# EAGLE design AlarmClock (EAGLE 5.11)
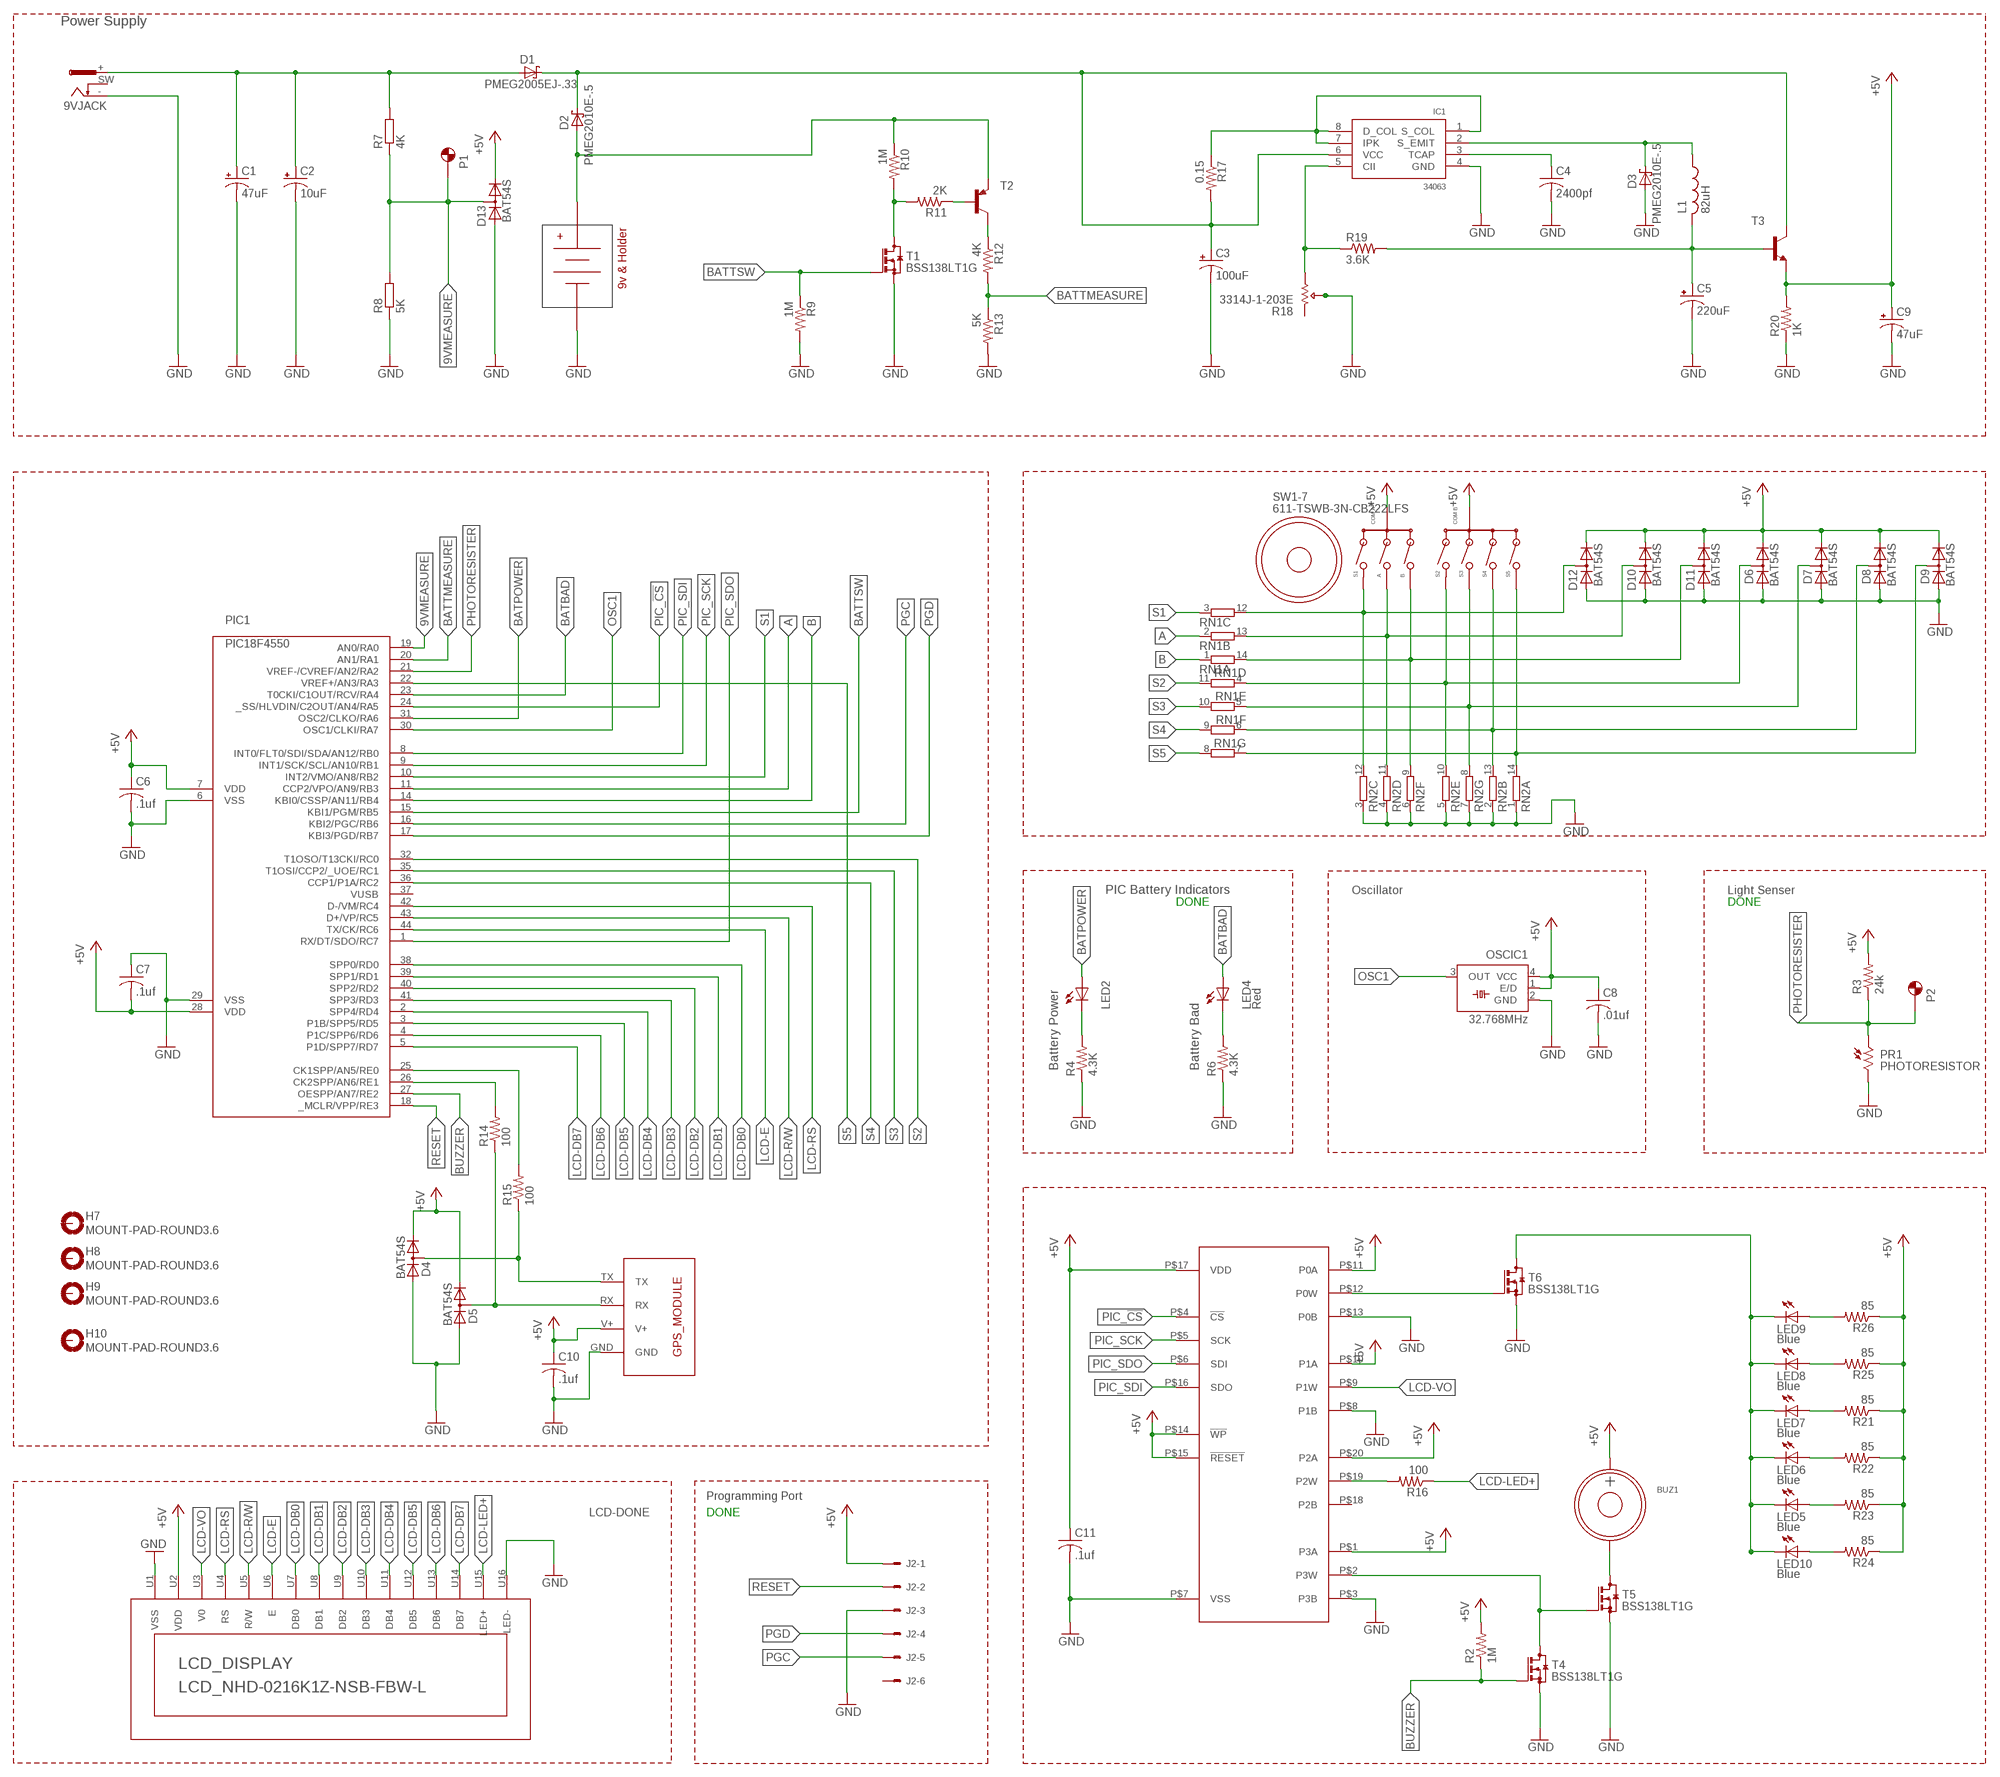
[diagram p0: schematic, sheet 1]

## Parts
9VJACK  PWR_JACK  [PWR_JACK]
BUZ1  SPEAKER2  [SPEAKER2]
C1  47uF  CPOL-USE2-5  [E2-5]
C2  10uF  CPOL-USE2-5  [E2-5]
C3  100uF  CPOL-USE2.5-5  [E2,5-5]
C4  2400pf  C-USC0805  [C0805]
C5  220uF  CPOL-USE2.5-5  [E2,5-5]
C6  .1uf  C-USC0805  [C0805]
C7  .1uf  C-USC0805  [C0805]
C8  .01uf  C-USC0805  [C0805]
C9  47uF  CPOL-USE2-5  [E2-5]
C10  .1uf  C-USC0805  [C0805]
C11  .1uf  C-USC0805  [C0805]
D1  PMEG2005EJ-.33  SMF5.0AT1  [SOD123FL]
D2  PMEG2010E-.5  SMF5.0AT1  [SOD123FL]
D3  PMEG2010E-.5  SMF5.0AT1  [SOD123FL]
D4  BAT54S  BAV199  [SOT23]
D5  BAT54S  BAV199  [SOT23]
D6  BAT54S  BAV199  [SOT23]
D7  BAT54S  BAV199  [SOT23]
D8  BAT54S  BAV199  [SOT23]
D9  BAT54S  BAV199  [SOT23]
D10  BAT54S  BAV199  [SOT23]
D11  BAT54S  BAV199  [SOT23]
D12  BAT54S  BAV199  [SOT23]
D13  BAT54S  BAV199  [SOT23]
H2  GPS_MODULE  [GPS_MODULE]
H7  MOUNT-PAD-ROUND3.6  [3,6-PAD]
H8  MOUNT-PAD-ROUND3.6  [3,6-PAD]
H9  MOUNT-PAD-ROUND3.6  [3,6-PAD]
H10  MOUNT-PAD-ROUND3.6  [3,6-PAD]
IC1  34063  MC34063A  [SOIC8]
J2  22-05-7068-06  [7395-06]
L1  82uH  744776182  [744776182]
LCD_DISPLAY  LCD_NHD-0216K1Z-NSB-FBW-L  [LCD_NHD-0216K1Z-NSB-FBW-L_LESS_PINS]
LED2  Blue  LEDCHIPLED_0603  [CHIPLED_0603]
LED4  Red  LEDCHIPLED_0603  [CHIPLED_0603]
LED5  Blue  LEDCHIPLED_0603  [CHIPLED_0603]
LED6  Blue  LEDCHIPLED_0603  [CHIPLED_0603]
LED7  Blue  LEDCHIPLED_0603  [CHIPLED_0603]
LED8  Blue  LEDCHIPLED_0603  [CHIPLED_0603]
LED9  Blue  LEDCHIPLED_0603  [CHIPLED_0603]
LED10  Blue  LEDCHIPLED_0603  [CHIPLED_0603]
OSCIC1  32.768MHz  SM77H  [SM77H]
P1  PAD-1  [PAD-1-50/25]
P2  PAD-1  [PAD-1-50/25]
PIC1  PIC18F4550  PIC18F4550-I/PT  [TQFP44]
PR1  PHOTORESISTOR  [PHOTORESISTOR]
R2  1M  R-US_M0805  [M0805]
R3  24k  R-US_M0805  [M0805]
R4  4.3K  R-US_M0805  [M0805]
R6  4.3K  R-US_M0805  [M0805]
R7  4K  R-EU_R0805  [R0805]
R8  5K  R-EU_R0805  [R0805]
R9  1M  R-US_M0805  [M0805]
R10  1M  R-US_M0805  [M0805]
R11  2K  R-US_M0805  [M0805]
R12  4K  R-US_M0805  [M0805]
R13  5K  R-US_M0805  [M0805]
R14  100  R-US_M0805  [M0805]
R15  100  R-US_M0805  [M0805]
R16  100  R-US_M0805  [M0805]
R17  0.15  R-US_M0805  [M0805]
R18  3314J-1-203E  [3314J-1-203E]
R19  3.6K  R-US_M0805  [M0805]
R20  1K  R-US_M0805  [M0805]
R21  85  R-US_M0805  [M0805]
R22  85  R-US_M0805  [M0805]
R23  85  R-US_M0805  [M0805]
R24  85  R-US_M0805  [M0805]
R25  85  R-US_M0805  [M0805]
R26  85  R-US_M0805  [M0805]
RN1  7R-NSOMC  [SOMC14]
RN2  7R-NSOMC  [SOMC14]
SW1-7  611-TSWB-3N-CB222LFS  [611-TSWB-3N-CB222LFS]
T1  BSS138LT1G  BSS123  [SOT23]
T2  BC856A-PNP-SOT23-BEC  [SOT23-BEC]
T3  BC818-NPN-SOT23-BEC  [SOT23-BEC]
T4  BSS138LT1G  BSS123  [SOT23]
T5  BSS138LT1G  BSS123  [SOT23]
T6  BSS138LT1G  BSS123  [SOT23]
U$1  9VBATTANHEADER  [9VBATTERYHOLDER]
U$3  DIGITALPOT_MCP4361-103E/ST  [DIGITALPOT_MCP4361-103E/ST]

## Nets
9V_SUPPLY: C3.+ D1.C D2.C IC1.6(VCC) R17.2 T3.C
9V_WALL1: 9VJACK.+ C1.+ C2.+ D1.A R7.2
9VMEASURE: D13.3(AC) P1.P$1 PIC1.19(AN0/RA0) R7.1 R8.2
+5V: BUZ1.POS C6.1 C7.2 C8.1 C9.+ C10.1 C11.1 D4.2(C) D5.2(C) D6.2(C) D7.2(C) D8.2(C) D9.2(C) D10.2(C) D11.2(C) D12.2(C) D13.2(C) H2.V+ J2.1 LCD_DISPLAY.U2(VDD) OSCIC1.1(E/D) OSCIC1.4(VCC) PIC1.7(VDD) PIC1.28(VDD) R2.2 R3.2 R20.2 R21.1 R22.1 R23.1 R24.1 R25.1 R26.1 SW1-7.COM-A SW1-7.COM-B T3.E U$3.P$1(P3A) U$3.P$10(P1A) U$3.P$11(P0A) U$3.P$14(!WP) U$3.P$15(!RESET) U$3.P$17(VDD) U$3.P$20(P2A)
A: PIC1.11(CCP2/VPO/AN9/RB3) RN1.2
B: PIC1.14(KBI0/CSSP/AN11/RB4) RN1.1
BATBAD: LED4.A PIC1.23(T0CKI/C1OUT/RCV/RA4)
BATPOWER: LED2.A PIC1.31(OSC2/CLKO/RA6)
BATTMEASURE: PIC1.20(AN1/RA1) R12.2 R13.1
BATTSW: PIC1.15(KBI1/PGM/RB5) R9.1 T1.1(G)
BUZZER: PIC1.27(OESPP/AN7/RE2) R2.1 T4.1(G)
GND: 9VJACK.- C1.- C2.- C3.- C4.2 C5.- C6.2 C7.1 C8.2 C9.- C10.2 C11.2 D3.A D4.1(A) D5.1(A) D6.1(A) D7.1(A) D8.1(A) D9.1(A) D10.1(A) D11.1(A) D12.1(A) D13.1(A) H2.GND IC1.4(GND) J2.3 LCD_DISPLAY.U1(VSS) LCD_DISPLAY.U16(LED-) OSCIC1.2(GND) PIC1.6(VSS) PIC1.29(VSS) PR1.P$2 R4.1 R6.1 R8.1 R9.2 R13.2 R18.WIPER R20.1 RN2.1 RN2.2 RN2.3 RN2.4 RN2.5 RN2.6 RN2.7 T1.2(S) T4.2(S) T5.2(S) T6.2(S) U$1.P$2- U$3.P$3(P3B) U$3.P$7(VSS) U$3.P$8(P1B) U$3.P$13(P0B)
LCD-DB0: LCD_DISPLAY.U7(DB0) PIC1.38(SPP0/RD0)
LCD-DB1: LCD_DISPLAY.U8(DB1) PIC1.39(SPP1/RD1)
LCD-DB2: LCD_DISPLAY.U9(DB2) PIC1.40(SPP2/RD2)
LCD-DB3: LCD_DISPLAY.U10(DB3) PIC1.41(SPP3/RD3)
LCD-DB4: LCD_DISPLAY.U11(DB4) PIC1.2(SPP4/RD4)
LCD-DB5: LCD_DISPLAY.U12(DB5) PIC1.3(P1B/SPP5/RD5)
LCD-DB6: LCD_DISPLAY.U13(DB6) PIC1.4(P1C/SPP6/RD6)
LCD-DB7: LCD_DISPLAY.U14(DB7) PIC1.5(P1D/SPP7/RD7)
LCD-E: LCD_DISPLAY.U6(E) PIC1.44(TX/CK/RC6)
LCD-LED+: LCD_DISPLAY.U15(LED+) R16.1
LCD-R/W: LCD_DISPLAY.U5(R/W) PIC1.43(D+/VP/RC5)
LCD-RS: LCD_DISPLAY.U4(RS) PIC1.42(D-/VM/RC4)
LCD-VO: LCD_DISPLAY.U3(V0) U$3.P$9(P1W)
N$1: R16.2 U$3.P$19(P2W)
N$2: LED2.C R4.2
N$3: LED10.A R24.2
N$4: R12.1 T2.C
N$6: LED4.C R6.2
N$7: LED5.A R23.2
N$8: LED8.A R25.2
N$9: D2.A R10.1 T2.E U$1.P$1+
N$10: R11.1 T2.B
N$11: LED9.A R26.2
N$12: LED7.A R21.2
N$13: R10.2 R11.2 T1.3(D)
N$14: D4.3(AC) H2.TX R15.1
N$15: D5.3(AC) H2.RX R14.1
N$16: IC1.1(S_COL) IC1.7(IPK) IC1.8(D_COL) R17.1
N$17: D3.C IC1.2(S_EMIT) L1.P$1
N$18: IC1.5(CII) R18.CCW(CW) R19.1
N$19: C4.1 IC1.3(TCAP)
N$20: T4.3(D) T5.1(G) U$3.P$2(P3W)
N$21: BUZ1.NEG T5.3(D)
N$22: LED6.A R22.2
N$23: D6.3(AC) RN1.4 RN2.10 SW1-7.S2
N$25: PIC1.25(CK1SPP/AN5/RE0) R15.2
N$26: PIC1.26(CK2SPP/AN6/RE1) R14.2
N$27: T6.1(G) U$3.P$12(P0W)
N$28: LED5.C LED6.C LED7.C LED8.C LED9.C LED10.C T6.3(D)
N$32: D12.3(AC) RN1.12 RN2.12 SW1-7.S1
N$33: D10.3(AC) RN1.13 RN2.11 SW1-7.A
N$34: D11.3(AC) RN1.14 RN2.9 SW1-7.B
N$35: D7.3(AC) RN1.5 RN2.8 SW1-7.S3
N$36: D8.3(AC) RN1.6 RN2.13 SW1-7.S4
N$37: D9.3(AC) RN1.7 RN2.14 SW1-7.S5
OSC1: OSCIC1.3(OUT) PIC1.30(OSC1/CLKI/RA7)
PGC: J2.5 PIC1.16(KBI2/PGC/RB6)
PGD: J2.4 PIC1.17(KBI3/PGD/RB7)
PHOTORESISTER: P2.P$1 PIC1.21(VREF-/CVREF/AN2/RA2) PR1.P$1 R3.1
PIC_!CS: PIC1.24(_SS/HLVDIN/C2OUT/AN4/RA5) U$3.P$4(!CS)
PIC_SCK: PIC1.9(INT1/SCK/SCL/AN10/RB1) U$3.P$5(SCK)
PIC_SDI: PIC1.8(INT0/FLT0/SDI/SDA/AN12/RB0) U$3.P$16(SDO)
PIC_SDO: PIC1.1(RX/DT/SDO/RC7) U$3.P$6(SDI)
RESET: J2.2 PIC1.18(_MCLR/VPP/RE3)
S1: PIC1.10(INT2/VMO/AN8/RB2) RN1.3
S2: PIC1.32(T1OSO/T13CKI/RC0) RN1.11
S3: PIC1.35(T1OSI/CCP2/_UOE/RC1) RN1.10
S4: PIC1.36(CCP1/P1A/RC2) RN1.9
S5: PIC1.22(VREF+/AN3/RA3) RN1.8
VOUT: C5.+ L1.P$2 R19.2 T3.B
Unconnected: 9VJACK.SW H7.B3,6(MOUNT) H8.B3,6(MOUNT) H9.B3,6(MOUNT) H10.B3,6(MOUNT) J2.6 PIC1.37(VUSB) R18.CW(CCW) U$3.P$18(P2B)

## Notes on the sheet
- Power Supply
- PIC Battery Indicators | Oscillator | Light Senser
- DONE | DONE
- Battery Power | Battery Bad
- Programming Port
- LCD-DONE | DONE

## Library data of the parts
9VJACK = ACommonPart:PWR_JACK
BUZ1 = alarmclock:SPEAKER2
C1-C3 C5 C9 = resistor:CPOL-US: POLARIZED CAPACITOR, American symbol
C4 C6-C8 C10 C11 = rcl:C-US: CAPACITOR, American symbol
D1-D3 = diode:SMF5.0AT1: 200 W Transient Voltage Suppressor Source: Data sheet <http://www.onsemi.com/pub_link/Collateral/SMF5.0AT1-D.PDF>
D4-D13 = diode:BAV199: DIODE low-leakage double diode
H2 = alarmclock:GPS_MODULE
H7-H10 = holes:MOUNT-PAD-ROUND: MOUNTING PAD, round
IC1 = microbuilder:MC34063A: MC34063A - 1.5A 3V-40V Boost/Buck/Inverting Voltage Regulator [Part No.] Allows you to 'boost', reduce or invert the voltage of your power supply to a more appropriate level. Common voltage regulators like the LM1117 are easy to use, but they can only 'reduce' the voltage level and require more volts than they provide, making them useless for low voltage power supplies like batteries or solar panels. A 'Step-Up' regulator like the MC34063A solves this problem by also allowing you to increase the voltage to a pre-determined level, though you still need to pay attention to the minimum voltage level the converter can handle, keeping in mind that many 'step-up' converts are less efficient at the two extreme ends of their working range. Given that many step-up circuits introduce some ripple to the power supply, you can often get a much 'smoother' supply by boosting the voltage up to 5.0V and then using a standard fixed voltage regulator (such as the common LM1117, etc.) to drop the voltage back down to 3.3V. This may not be necessary, and some step up regulators can provide a smooth supply on their own, but it's worth keeping in mind if you do encounter some ripple in the power supply using only a step-up IC for your power supply. Texas Instruments MC34063A Digikey: 296-17765-1-ND
J2 = ep_molex_6410_7395-02:22-?-06: CONNECTOR wire to board 2.54 mm (.1 inch) pitch header
L1 = alarmclock:744776182
LCD_DISPLAY = Project_AlarmClock:LCD_NHD-0216K1Z-NSB-FBW-L: Mouser Part #: 763-0216K1Z-NSB-FBW Manufacturer Part #: NHD-0216K1Z-NSB-FBW-L Manufacturer: Newhaven Display Description: LCD Character Display Modules FSTN (-) Transm 80.0 x 36.0
LED2 LED4-LED10 = led:LED: LED OSRAM: - CHIPLED LG R971, LG N971, LY N971, LG Q971, LY Q971, LO R971, LY R971 LH N974, LH R974 LS Q976, LO Q976, LY Q976 LO Q996 - Hyper CHIPLED LW Q18S LB Q993, LB Q99A, LB R99A - SideLED LS A670, LO A670, LY A670, LG A670, LP A670 LB A673, LV A673, LT A673, LW A673 LH A674 LY A675 LS A676, LA A676, LO A676, LY A676, LW A676 LS A679, LY A679, LG A679 - Hyper Micro SIDELED® LS Y876, LA Y876, LO Y876, LY Y876 LT Y87S - SmartLED LW L88C, LW L88S LB L89C, LB L89S, LG L890 LS L89K, LO L89K, LY L89K LS L896, LA L896, LO L896, LY L896 - TOPLED LS T670, LO T670, LY T670, LG T670, LP T670 LSG T670, LSP T670, LSY T670, LOP T670, LYG T670 LG T671, LOG T671, LSG T671 LB T673, LV T673, LT T673, LW T673 LH T674 LS T676, LA T676, LO T676, LY T676, LB T676, LH T676, LSB T676, LW T676 LB T67C, LV T67C, LT T67C, LS T67K, LO T67K, LY T67K, LW E67C LS E67B, LA E67B, LO E67B, LY E67B, LB E67C, LV E67C, LT E67C LW T67C LS T679, LY T679, LG T679 LS T770, LO T770, LY T770, LG T770, LP T770 LB T773, LV T773, LT T773, LW T773 LH T774 LS E675, LA E675, LY E675, LS T675 LS T776, LA T776, LO T776, LY T776, LB T776 LHGB T686 LT T68C, LB T68C - Hyper Mini TOPLED® LB M676 - Mini TOPLED Santana® LG M470 LS M47K, LO M47K, LY M47K Source: http://www.osram.convergy.de LUXEON: - LUMILED® LXK2-PW12-R00, LXK2-PW12-S00, LXK2-PW14-U00, LXK2-PW14-V00 LXK2-PM12-R00, LXK2-PM12-S00, LXK2-PM14-U00 LXK2-PE12-Q00, LXK2-PE12-R00, LXK2-PE12-S00, LXK2-PE14-T00, LXK2-PE14-U00 LXK2-PB12-K00, LXK2-PB12-L00, LXK2-PB12-M00, LXK2-PB14-N00, LXK2-PB14-P00, LXK2-PB14-Q00 LXK2-PR12-L00, LXK2-PR12-M00, LXK2-PR14-Q00, LXK2-PR14-R00 LXK2-PD12-Q00, LXK2-PD12-R00, LXK2-PD12-S00 LXK2-PH12-R00, LXK2-PH12-S00 LXK2-PL12-P00, LXK2-PL12-Q00, LXK2-PL12-R00 Source: www.luxeon.com KINGBRIGHT: KA-3528ASYC Source: www.kingbright.com
OSCIC1 = crystal:SM77H: 3.3V CMOS Clock Oscillator Source: www.pletronics.com .. sm77h%203.3v.pdf; OC_FARNELL: unknown; OC_NEWARK: unknown
P1 P2 = ACommonPart:PAD-1
PIC1 = microchip-pic18fxx5x:PIC18*4550: PIC18*4550 Microchip FLASH Microcontroller with FS-USB DEVICE FEATURES Feature PIC18*4550 Program Memory (bytes) 32k Program Memory (instructions) 16384 I/O Ports Ports A, B, C, D, E Capture/Compare/PWM Modules 1 Enhanced Capture/Compare/PWM Modules 1 Parallel Communications (PSP) Yes 10-bit Analog-to-Digital Module 13 input Channels Package Types 40-pin PDIP 44-pin TQFP (44-pin QFN) NOTES: F only after 18, means standard voltage range from 4.2v to 5.5v LF after 18, means extended voltage range from 2.0v to 5.5v T after entire device number, means supplied in tape and reel TQFP packages only -E before / denotes extended temperature range from -40°C to +120°C -I before / denotes industrial temperature range from -40°C to +85°C /PT suffix denotes TQFP package /SO suffix denotes SOIC package /SP suffix denotes Skinny Plastic DIP package /P suffix denotes Plastic DIP package /ML suffix denotes QFN package
PR1 = alarmclock:PHOTORESISTOR
R2-R4 R6 R9-R17 R19-R26 = rcl:R-US_: RESISTOR, American symbol
R7 R8 = resistor:R-EU_: RESISTOR, European symbol
R18 = alarmclock:3314J-1-203E
RN1 RN2 = resistor-dil:7R-N: DIL RESISTOR; OC_FARNELL: unknown; OC_NEWARK: unknown
SW1-7 = alarmclock:611-TSWB-3N-CB222LFS
T1 T4-T6 = transistor-small-signal:BSS123: N-CHANNEL MOS FET
T2 = transistor:*-PNP-: PNP Transistror
T3 = transistor:*-NPN-: NPN Transistror BF959 corrected 2008.03.06
U$1 = alarmclock:9VBATTANHEADER
U$3 = Project_AlarmClock:DIGITALPOT_MCP4361-103E/ST

## Board
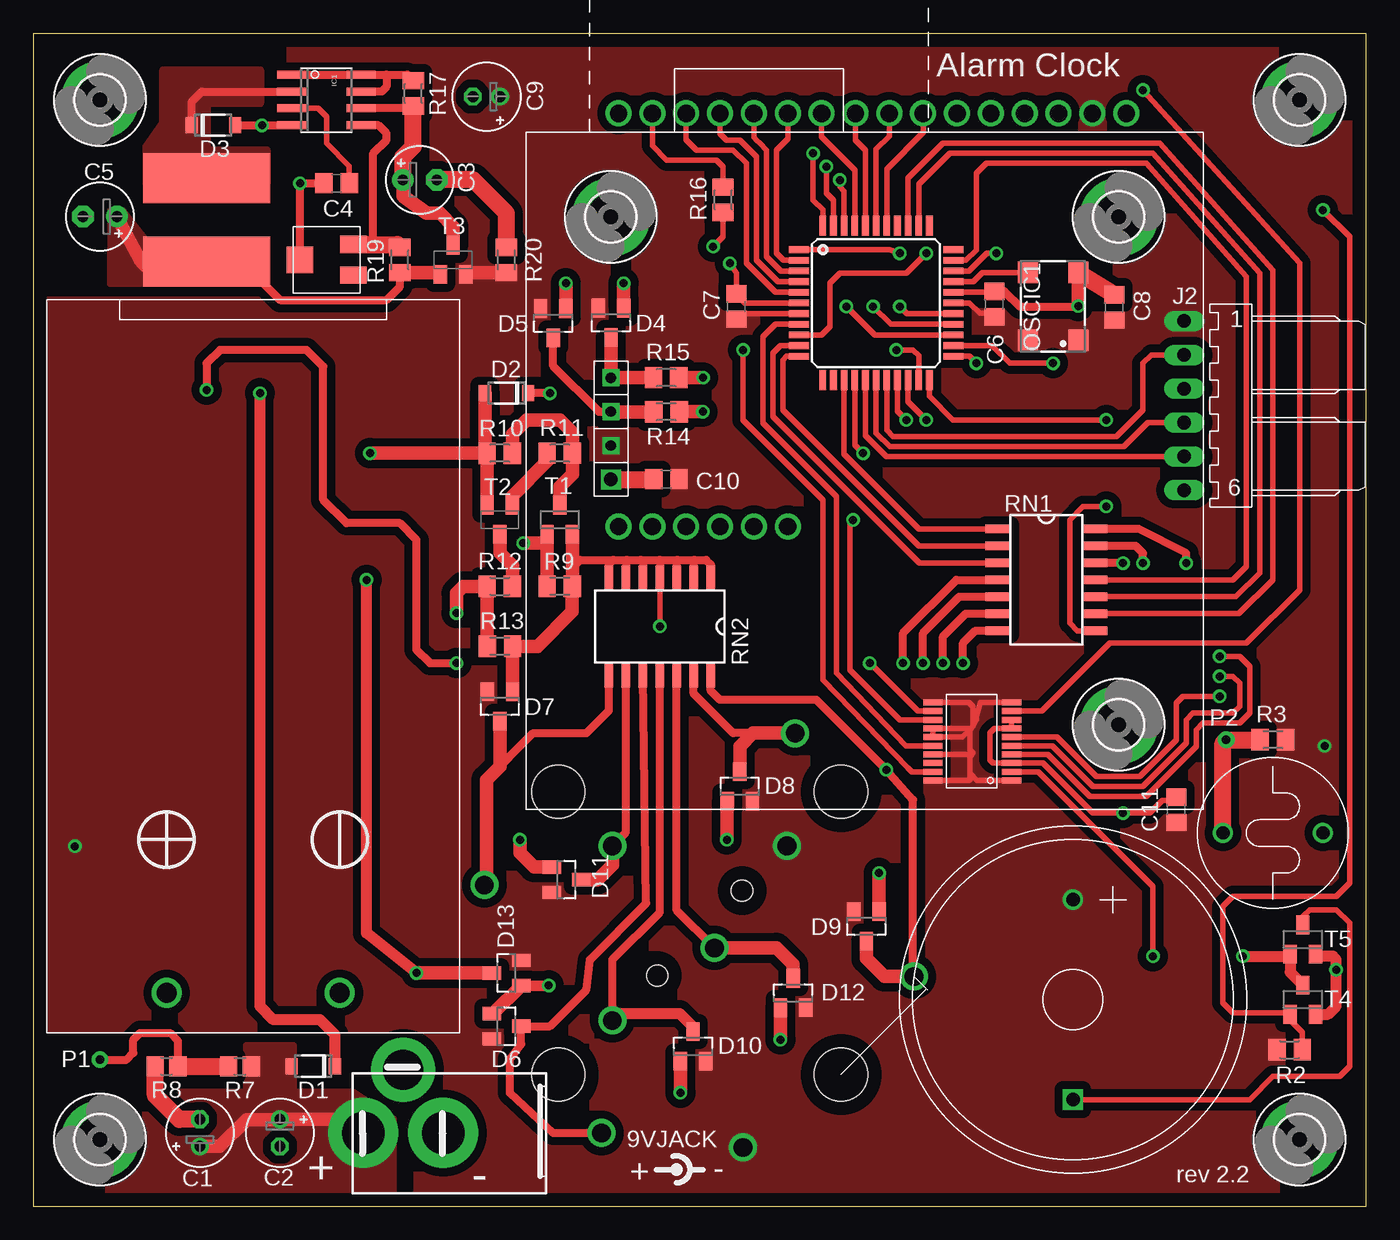
[diagram p1: board, top side]
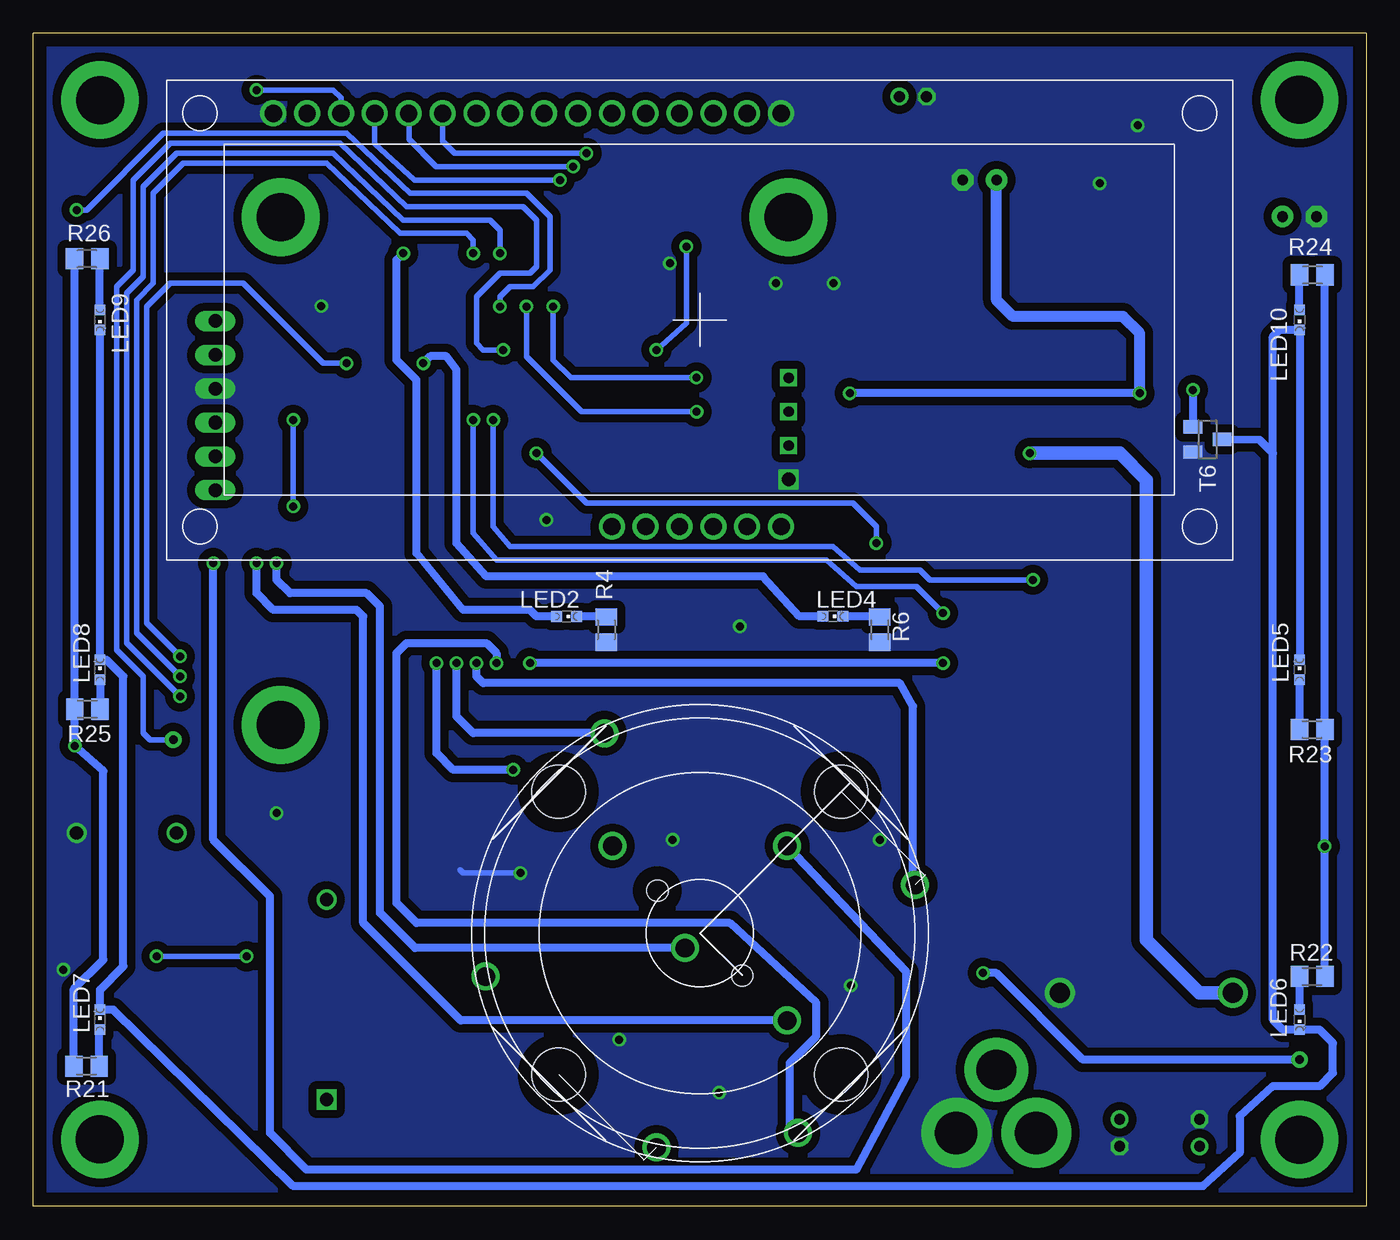
[diagram p2: board, bottom side, seen from below]

Size 100 x 88 mm. Coordinates in mm from the lower left corner, seen from the top.
Outline: 0,0 100,0 100,88 0,88 0,0
Copper layers (1*16): Top 0.035mm / dielectric 1.5mm / Bottom 0.035mm
Design rules "default *": minimum track width 10mil, minimum drill 0.5mm, track to track 0.2mm, track to pad 0.2mm, pad to pad 0.2mm, via to via 0.2mm, smd to smd 0.2mm, copper to edge 40mil, drill to drill 8mil, minimum pad ring 10mil, minimum via ring 8mil, stop-mask expansion 4mil, vias tented up to drill 0mil, thermal gap 10mil

### Footprints (pad centres in the part's own frame; a part is rotated, then mirrored left to right if it is on the bottom)
PWR_JACK = drill 3.175 pad 5.25 round: + 5.75,0; - -0.25,0 | drill 2.997 pad 4.8 round: SW 2.75,-4.75
SPEAKER2 = drill 1 square: NEG 0,-7.5 | drill 1 round: POS 0,7.5
E2-5 = drill 0.813 pad 1.27 round: + -1.016,0 | drill 0.813 pad 1.27 octagon: - 1.016,0
E2,5-5 = drill 0.813 pad 1.6 round: + -1.27,0 | drill 0.813 pad 1.6 octagon: - 1.27,0
C0805 = smd 1.3 x 1.5: 1 -0.95,0; 2 0.95,0
SOD123FL = smd 0.91 x 1.22: A 1.625,0; C -1.625,0
SOT23 = smd 1 x 1.4: 1 -0.95,-1.1; 2 0.95,-1.1; 3 0,1.1
GPS_MODULE = drill 3.6 pad 5.842 round: B3,1 6.35,44.45; B3,3 44.45,44.45; B3,6 44.45,6.35 | drill 1 square: GND 6.351,24.763 | drill 0.762 square: RX 6.351,29.843; TX 6.351,32.383; V+ 6.351,27.303
3,6-PAD = drill 3.6 pad 5.842 round: B3,6 0,0
SOIC8 = smd 0.6 x 2.2: 1 -1.905,-2.6; 2 -0.635,-2.6; 3 0.635,-2.6; 4 1.905,-2.6; 5 1.905,2.6; 6 0.635,2.6; 7 -0.635,2.6; 8 -1.905,2.6
7395-06 = drill 1.016 long: 1 6.35,0; 2 3.81,0; 3 1.27,0; 4 -1.27,0; 5 -3.81,0; 6 -6.35,0
744776182 = smd 9.5 x 3.75: P$1 0,3.125; P$2 0,-3.125
LCD_NHD-0216K1Z-NSB-FBW-L_LESS_PINS = drill 1.3 round: L11 33.4,2.5; L12 35.94,2.5; L13 38.48,2.5; L14 41.02,2.5; L15 43.56,2.5; L16 46.1,2.5; U1 8,33.5; U2 10.54,33.5; U3 13.08,33.5; U4 15.62,33.5; U5 18.16,33.5; U6 20.7,33.5; U7 23.24,33.5; U8 25.78,33.5; U9 28.32,33.5; U10 30.86,33.5; U11 33.4,33.5; U12 35.94,33.5; U13 38.48,33.5; U14 41.02,33.5; U15 43.56,33.5; U16 46.1,33.5
CHIPLED_0603 = smd 0.8 x 0.8: A 0,-0.75; C 0,0.75
SM77H = smd 1.6 x 1.5: 1 -2.55,-1.9; 2 2.55,-1.9; 3 2.55,1.9; 4 -2.55,1.9
PAD-1-50/25 = drill 0.635 pad 1.27 round: P$1 0,0
TQFP44 = smd 1.5 x 0.5: 1 -5.8,4; 2 -5.8,3.2; 3 -5.8,2.4; 4 -5.8,1.6; 5 -5.8,0.8; 6 -5.8,0; 7 -5.8,-0.8; 8 -5.8,-1.6; 9 -5.8,-2.4; 10 -5.8,-3.2; 11 -5.8,-4; 23 5.8,-4; 24 5.8,-3.2; 25 5.8,-2.4; 26 5.8,-1.6; 27 5.8,-0.8; 28 5.8,0; 29 5.8,0.8; 30 5.8,1.6; 31 5.8,2.4; 32 5.8,3.2; 33 5.8,4 | smd 0.5 x 1.5: 12 -4,-5.8; 13 -3.2,-5.8; 14 -2.4,-5.8; 15 -1.6,-5.8; 16 -0.8,-5.8; 17 0,-5.8; 18 0.8,-5.8; 19 1.6,-5.8; 20 2.4,-5.8; 21 3.2,-5.8; 22 4,-5.8; 34 4,5.8; 35 3.2,5.8; 36 2.4,5.8; 37 1.6,5.8; 38 0.8,5.8; 39 0,5.8; 40 -0.8,5.8; 41 -1.6,5.8; 42 -2.4,5.8; 43 -3.2,5.8; 44 -4,5.8
PHOTORESISTOR = drill 1 round: P$1 -3.75,0; P$2 3.75,0
M0805 = smd 1.3 x 1.6: 1 -0.95,0; 2 0.95,0
R0805 = smd 1.3 x 1.5: 1 -0.85,0; 2 0.85,0
3314J-1-203E = smd 1.3 x 2: CCW -1.15,2; CW 1.15,2 | smd 2 x 2: WIPER 0,-2
SOMC14 = smd 1.91 x 0.64: 1 -3.62,3.81; 2 -3.62,2.54; 3 -3.62,1.27; 4 -3.62,0; 5 -3.62,-1.27; 6 -3.62,-2.54; 7 -3.62,-3.81; 8 3.62,-3.81; 9 3.62,-2.54; 10 3.62,-1.27; 11 3.62,0; 12 3.62,1.27; 13 3.62,2.54; 14 3.62,3.81
611-TSWB-3N-CB222LFS = drill 1.4 round: A 6.558,-6.565; B 6.558,6.531; COM-A -6.538,6.531; COM-B -3.243,-16.097; S1 -1.1,-1.127; S2 7.364,-15.008; S3 16.16,3.589; S4 -7.158,14.982; S5 -16.07,-3.27 | hole 1.6: 3.192,-3.199; -3.172,3.165 | hole 4: 10.617,10.589; -10.597,-10.624; -10.597,10.589; 10.617,-10.624
SOT23-BEC = smd 1 x 1.4: B -0.95,-1.1; C 0,1.1; E 0.95,-1.1
9VBATTERYHOLDER = drill 1.5 round: P$1+ 3,6.5; P$2- 3,-6.5
DIGITALPOT_MCP4361-103E/ST = smd 0.45 x 1.45: P$1 0,0; P$2 0.65,0; P$3 1.3,0; P$4 1.95,0; P$5 2.6,0; P$6 3.25,0; P$7 3.9,0; P$8 4.55,0; P$9 5.2,0; P$10 5.85,0; P$11 5.85,5.9; P$12 5.2,5.9; P$13 4.55,5.9; P$14 3.9,5.9; P$15 3.25,5.9; P$16 2.6,5.9; P$17 1.95,5.9; P$18 1.3,5.9; P$19 0.65,5.9; P$20 0,5.9

### Placement (x,y rotation side)
9VJACK  30.5,5.49 180 top
BUZ1  78,15.5 0 top
C1  12.5,5.5 90 top
C2  18.5,5.5 270 top
C3  29,77 0 top
C4  22.75,76.75 180 top
C5  5,74.25 180 top
C6  72.1,67.68 90 top
C7  52.75,67.5 270 top
C8  81.1,67.43 90 top
C9  34,83.25 180 top
C10  47.49,54.55 180 top
C11  85.75,29.75 90 top
D1  21,10.5 180 top
D2  35.5,61 180 top
D3  13.51,81.1 0 top
D4  43.34,66.28 180 top
D5  39,66.25 180 top
D6  35.5,13.5 270 top
D7  35,37.5 180 top
D8  53,31.5 0 top
D9  62.5,21 180 top
D10  49.5,12 0 top
D11  40,24.5 270 top
D12  57,16 0 top
D13  35.5,17.5 90 top
H2  36.98,29.77 0 top
H7  95,5 0 top
H8  5,83 0 top
H9  5,5 0 top
H10  95,83 0 top
IC1  22,83 270 top
J2  86.35,60.06 90 top
L1  13,74 0 top
LCD_DISPLAY  90,48.5 0 bottom
LED2  60,44.25 270 bottom
LED4  40,44.25 270 bottom
LED5  5,40.25 0 bottom
LED6  5,14 180 bottom
LED7  95,14 0 bottom
LED8  95,40.25 0 bottom
LED9  95,66.5 180 bottom
LED10  5,66.5 180 bottom
OSCIC1  76.5,67.5 90 top
P1  5,11 0 top
P2  89.5,35 0 top
PIC1  63.23,67.77 0 top
PR1  93,28 0 top
R2  94.25,11.74 180 top
R3  93,35 0 top
R4  57,43.25 90 bottom
R6  36.5,43.25 90 bottom
R7  15.5,10.5 0 top
R8  10,10.5 0 top
R9  39.5,46.5 0 top
R10  35,56.5 0 top
R11  39.5,56.5 0 top
R12  35,46.5 180 top
R13  35,42 0 top
R14  47.5,59.6 0 top
R15  47.48,62.16 0 top
R16  51.75,75.5 270 top
R17  28.5,83.5 270 top
R18  22,71 270 top
R19  27.5,71 270 top
R20  35.5,71 270 top
R21  96,10.5 0 bottom
R22  4.05,17.24 180 bottom
R23  4.05,35.77 180 bottom
R24  4.04,69.88 180 bottom
R25  95.94,37.28 0 bottom
R26  95.96,71.09 0 bottom
RN1  76,47 0 top
RN2  47,43.5 270 top
SW1-7  50,20.5 0 bottom
T1  39.5,51.5 0 top
T2  35,51.5 180 top
T3  31.5,71 0 top
T4  95.25,15.5 0 top
T5  95.25,20 0 top
T6  11.91,57.53 270 bottom
U$1  16.5,13 90 top
U$3  73.39,31.95 90 top

### Tracks (layer width: path | path; a pad name or v marks a point on that pad's centre or on a via)
9V_SUPPLY  (via drill 0.6)
  Top 0.61: T3.C | IC1.6 28.32,82.36 R17.2 | D2.C v38.75,61
  Top 0.813: v17,61 17,15 18,14 21.5,14 22.63,12.87 D1.C
  Top 1.016: C3.+ 27.73,75.77 29.5,74.5 30.5,74.5 31.5,73.5 T3.C
  Top 1.27: C3.+ 27.73,78.73 28.5,79.5 R17.2 | R17.2
  Bottom 0.61: v17,61 v38.75,61
  Bottom 0.813: C3.+ 27.73,67.98 26.5,66.75 18.25,66.75 17,65.5 v17,61
9V_WALL1
  Top 1.016: C1.+ 13.98,4.49 16,6.5 18.48,6.5 C2.+ 23.73,6.52 9VJACK.+
  pour Top (isolate 0.61, no thermals): 1,1 27,1 27,6.5 24,8.5 19.5,8.5 19.5,12 16,12 16,8.5 1,8.5
9VMEASURE  (via drill 0.6)
  Top 0.406: PIC1.19 64.83,59.67 v65.5,59
  Top 0.61: R8.2 10.85,12.4 10.25,13 8,13 7.5,12.5 7.5,11.5 7,11 P1.P$1
  Top 0.813: v25,47 25,20.5 v28.75,17.5
  Top 1.016: v28.75,17.5 D13.3
  Top 1.27: R8.2 R7.1
  Bottom 0.406: v65.5,59 65.5,51 64.25,49.5 40,49.5 38,47.75 33.5,47.75 32.75,47 v25,47
  Bottom 0.61: P1.P$1 21.25,11 27.75,17.5 v28.75,17.5
+5V  (via drill 0.6)
  Top 0.406: PIC1.7 53.38,66.97 C7.2 | PIC1.28 70.23,67.77 71,67 71.83,67 C6.1 | 70.25,35.75 70.15,35.85 U$3.P$14 U$3.P$15 69.7,35.2 70.25,35.75 | 70.4,33.9 U$3.P$17 | 70.4,33.9 70.5,34 70.25,34.25 70.25,35.75 | U$3.P$20 70.2,31.95 70.25,32 70.25,32.5 | 70.25,32.5 70.25,33.75 70.4,33.9 | U$3.P$1 70.8,31.95 70.25,32.5 | U$3.P$10 71.05,37.8 70.75,36.75 70.75,36.5 70.5,36 | U$3.P$11 70.2,37.8 70.5,37.5 70.5,36 | 70.25,35.75 70.5,36
  Top 1.016: R20.2 32.59,70.05 T3.E
  Bottom 0.61: R24.1 R23.1 v3.11,27 R22.1 | R21.1 96.95,16.3 94.75,18.5 94.75,32.64 v96.89,34.53 R25.1 96.91,37.3 R26.1
  pour Top (isolate 0.61, no thermals): 99,1 29,1 29,13.5 1,13.5 1,67.75 19.5,67.75 19.5,87 99,87
A
  Top 0.406: PIC1.11 56.52,63.77 56.25,63.5 56.25,59.75 66.46,49.54 RN1.2
B
  Top 0.406: PIC1.14 60.83,56.42 66.44,50.81 RN1.1
BATBAD  (via drill 0.6)
  Top 0.406: PIC1.23 70.23,63.77 v70.75,63.25
  Bottom 0.61: LED4.A 42.5,44.25 45.25,47.25 66,47.25 68.25,49.75 68.25,62.74 PIC1.23 70.23,63.77 v70.75,63.25
BATPOWER  (via drill 0.6)
  Top 0.406: v72.25,71.5 71.53,71.5 70.2,70.17 PIC1.31
  Bottom 0.61: LED2.A 62.25,44.25 62.75,44.75 67.75,44.75 71.25,49 71.25,62 72.75,63.5 72.75,71 v72.25,71.5
BATTMEASURE  (via drill 0.6)
  Top 0.406: PIC1.20 65.63,60.37 v67,59
  Top 1.016: R13.1 R12.2 34,46.5 32.25,46.5 31.75,46 v31.75,44.5
  Bottom 0.406: v67,59 67,50.5 65.25,48.5 40.5,48.5 38.25,46.5 33.75,46.5 v31.75,44.5
BATTSW  (via drill 0.6)
  Top 0.406: PIC1.15 61.63,57.12 v62.25,56.5
  Top 1.016: R9.1 38.55,49.75 | 38.55,49.75 T1.1 | 38.55,49.75 v36.75,49.75
  Bottom 0.406: v62.25,56.5 58.5,52.75 38.5,52.75 36.75,51 v36.75,49.75
BUZZER  (via drill 0.6)
  Top 0.406: PIC1.27 65.53,66.97 v65,67.5 | v96.75,74.75 98.75,72.75 98.75,24.25 97.75,23.25 90,23.25 89.25,22.5 89.25,15.25 90,14.5 94.2,14.5 T4.1 94.3,13.94 95.2,13.03 R2.1
  Bottom 0.406: v65,67.5 65,68.25 64.25,69 62.5,69 61.25,70.25 61.25,74.25 63,76 71.75,76 76.5,80.5 90.25,80.5 96,74.75 v96.75,74.75
GND  (via drill 0.6)
  Top 0.406: PIC1.6 53.37,67.77 C7.1 52.75,70 v52.25,70.75 | 43.19,48.19 RN2.7 | 50.83,47.14 RN2.1 | 44.52,48.5 44.46,48.44 | 45.56,48.5 45.73,48.33 | 48.3,48.5 48.27,48.47 | 49.58,48.5 49.54,48.46 | RN2.4 v47,43.5 | R9.2 40.45,47.95 | PIC1.29 72.04,68.57 C6.2 | U$3.P$8 U$3.P$7 72.1,35.85 71.75,35.5 71.75,33.5 72,33.25 U$3.P$3 75.75,33.25 79.5,29.5 v81.75,29.5 83.75,29.5 84.71,30.46 85.74,30.46 C11.2 | v39.95,69.25 | v44.29,69.25 | U$3.P$13 65,36.5 61.25,40.25 61.25,51.25 v61.5,51.5 | 78.36,67.5 v78.39,67.53
  Top 0.61: 43.5,48.5 43.19,48.19 | 43.5,48.5 44.52,48.5 45.56,48.5 47,48.5 | 47,48.5 48.3,48.5 49.58,48.5 50.48,48.5 50.83,48.15 50.83,47.14 | 44.46,48.44 RN2.6 | 45.73,48.33 RN2.5 | 47,48.5 RN2.4 | 48.27,48.47 RN2.3 | 49.54,48.46 RN2.2 | 40.45,47.95 41,48.5 43.5,48.5 | IC1.4 v17.16,81.09 v17.15,81.1 D3.A | D3.A | C4.2 v20,76.75 R18.WIPER | 46.52,54.53 C10.2 | C6.2 72.87,68.63 74,67.5 78.36,67.5
  Top 0.813: D13.1 v38.67,16.56 | 96.35,14.25 T4.2 97.15,14.4 97.75,15 v97.75,17.75 97.75,18.5 97.5,18.75 96.35,18.75 T5.2
  Top 1.016: T1.2 R9.2 40.43,46.48 40.43,44.62 37.82,42 R13.2 D7.1 | v52.03,27.5 52.03,30.33 D8.1 | v63.45,25 63.44,22.15 D9.1 | D11.1 37.55,25.45 36.5,26.5 v36.5,27.5 | D6.1 34.5,14.45 D13.1 | v78.39,67.53 OSCIC1.2 | D5.1 v39.95,69.25 | D4.1 v44.29,69.25 | v56.05,12.5 D12.1 | v48.55,8.51 48.55,10.8 D10.1
  Top 1.27: C3.- 33,77 35.5,74.5 R20.1 | R8.1 9.15,8.31 10.94,6.51 C1.- | OSCIC1.2 C8.2 | H2.GND 46.52,54.53
  Bottom 0.406: v63.45,25 67.75,25 68,25.25
  pour Bottom (isolate 0.61, no thermals): 0.5,87.5 0.5,0.5 99.5,0.5 99.5,87.5
LCD-DB0
  Top 0.406: PIC1.38 64.03,77.82 66.78,80.57 66.78,81.98 LCD_DISPLAY.U7
LCD-DB1
  Top 0.406: PIC1.39 63.23,79.3 64.22,80.29 LCD_DISPLAY.U8
LCD-DB2
  Top 0.406: PIC1.40 62.43,79.23 61.68,79.99 LCD_DISPLAY.U9
LCD-DB3
  Top 0.406: PIC1.41 61.63,77.74 59.14,80.24 LCD_DISPLAY.U10
LCD-DB4
  Top 0.406: PIC1.2 56.28,70.97 55.75,71.5 55.75,79.25 56.6,80.1 LCD_DISPLAY.U11
LCD-DB5
  Top 0.406: PIC1.3 56.08,70.17 55,71.25 55,79.25 54.5,79.75 54.25,80 54.06,80.19 LCD_DISPLAY.U12
LCD-DB6
  Top 0.406: PIC1.4 55.88,69.37 54.25,71 54.25,78.75 53,80 52,80 51.52,80.48 LCD_DISPLAY.U13
LCD-DB7
  Top 0.406: PIC1.5 55.68,68.57 53.5,70.75 53.5,78.25 52.5,79.25 49.75,79.25 48.98,80.02 LCD_DISPLAY.U14
LCD-E  (via drill 0.6)
  Top 0.406: PIC1.44 59.23,74.77 58.5,75.5 v58.5,79
  Bottom 0.406: v58.5,79 68.4,79 69.31,79.91 LCD_DISPLAY.U6
LCD-LED+
  Top 0.406: LCD_DISPLAY.U15 46.44,79.56 47.5,78.5 51.25,78.5 51.75,78 R16.1
LCD-R/W  (via drill 0.6)
  Top 0.406: PIC1.43 60.03,75.47 59.5,76 v59.5,78
  Bottom 0.406: v59.5,78 69.77,78 71.82,80.05 71.82,81.98 LCD_DISPLAY.U5
LCD-RS  (via drill 0.6)
  Top 0.406: PIC1.42 60.83,76.17 60.5,76.5 v60.5,77
  Bottom 0.406: v60.5,77 71.41,77 74.38,79.72 LCD_DISPLAY.U4
LCD-VO  (via drill 0.6)
  Top 0.406: U$3.P$9 75.65,37.15 80.75,42.25 91,42.25 95,46.25 95,70.75 v83.25,83.75
  Bottom 0.406: LCD_DISPLAY.U3 76.92,83.17 77.5,83.75 v83.25,83.75
N$1  (via drill 0.6)
  Top 0.406: v53.25,64.25 53.25,59 59.25,53 59.25,39.5 65.62,32.89 | R16.2 51.75,72.75 v51,72 | 65.62,32.89 65.9,32.6 | U$3.P$19 65.92,32.6 65.62,32.89
  Bottom 0.406: v53.25,64.25 51,66.25 v51,72
N$2
  Bottom 0.61: LED2.C 57.05,44.25 R4.2
N$3
  Bottom 0.61: LED10.A 5,69.87 R24.2
N$4
  Top 1.016: R12.1 35.95,48.05 35,49 T2.C
N$6
  Bottom 0.61: LED4.C 36.55,44.25 R6.2
N$7
  Bottom 0.61: R23.2 LED5.A
N$8
  Bottom 0.61: LED8.A R25.2
N$9  (via drill 0.6)
  Top 1.016: R10.1 T2.E | D2.A 33.88,56.67 R10.1 | v25.25,56.5 R10.1
  Bottom 1.016: U$1.P$1+ 12.5,16 16.5,20 16.5,54.5 18.5,56.5 v25.25,56.5
N$10
  Top 1.016: R11.1 38.55,55.91 35.94,53.3 T2.B
N$11
  Bottom 0.61: LED9.A R26.2
N$12
  Bottom 0.61: R21.2 95.05,13.2 LED7.A
N$13
  Top 1.016: T1.3 39.5,54 40.45,54.95 R11.2 40.45,58.05 39.5,59 37,59 35.95,57.95 R10.2
N$14
  Top 0.406: H2.TX 43.34,62.16 | D4.3
  Top 1.016: R15.1 43.34,62.16 D4.3
N$15
  Top 0.406: 43.34,59.6 H2.RX
  Top 0.61: D5.3 39,63.05 42.44,59.61 H2.RX
  Top 1.016: 43.34,59.6 R14.1
N$16
  Top 0.61: 26.5,84.9 IC1.8 IC1.1 | 26.5,84.9 28.04,84.9 R17.1 | IC1.7 26.13,83.64 26.5,84 26.5,84.9
N$17
  Top 0.61: L1.P$1 12.63,77.5 12,77.5 11.88,77.62 | IC1.2 12.63,83.64 11.88,82.88 D3.C
  pour Top (no thermals): 8.5,76.75 8.5,79.5 9.75,81.25 9.75,85.25 17,85.25 17,82.75 13,82.75 13,79.25 17.5,79.25 17.5,76.75
N$18
  Top 0.61: IC1.5 25.91,81.09 26.5,80.5 26.5,80 25.5,79 25.5,72.65 25,72.15
  Top 1.27: R18.CCW 25,72.15 27.3,72.15 R19.1
N$19
  Top 0.406: IC1.3 21.39,82.36 22,81.75 22,79.75 23.7,78.05 C4.1
N$20  (via drill 0.6)
  Top 0.406: U$3.P$2 75.4,32.6 84,24 v84,18.75
  Top 0.813: T4.3 94.3,17.55 T5.1 94.15,18.75 v90.75,18.75
  Bottom 0.406: v84,18.75 v90.75,18.75
N$21
  Top 0.406: BUZ1.NEG 91.25,8 93,9.75 98,9.75 98.75,10.5 98.75,21.25 97.75,22.25 95.75,22.25 95.25,21.75 T5.3
N$22
  Bottom 0.61: LED6.A R22.2
N$23  (via drill 0.6)
  Top 0.61: RN2.10 45.98,22.73 41.75,18.5 41.5,16.25 38.75,13.5 D6.3 | SW1-7.S2 39.01,5.49 35.75,8.5 35.75,11.06 36.61,12.17 D6.3 | RN1.4 69.25,47 65.25,43 v65.25,40.75 | 36.25,13.25 36.25,13.5 D6.3
  Bottom 0.61: SW1-7.S2 43.25,6.11 43.25,10.75 41.25,12.75 41.25,15.25 47.75,21.25 71.25,21.25 72.75,22.75 72.75,41.5 72,42.25 66,42.25 65.25,41.5 v65.25,40.75
N$25  (via drill 0.6)
  Top 0.406: PIC1.25 63.13,65.37 v61,67.5 | R15.2
  Top 1.016: R15.2 v50.25,62.17
  Bottom 0.406: v50.25,62.17 59.67,62.17 61,63.5 v61,67.5
N$26  (via drill 0.6)
  Top 0.406: PIC1.26 64.33,66.17 v63,67.5 | R14.2
  Top 1.016: R14.2 v50.23,59.6
  Bottom 0.406: v50.23,59.6 58.85,59.6 63,63.75 v63,67.5
N$27  (via drill 0.6)
  Top 0.406: U$3.P$12 66.35,37.15 v62.75,40.75
  Top 0.61: v13,61.25 13,63.25 14,64.25 20.5,64.25 21.75,63 21.75,53 23.5,51.25 27.5,51.25 28.75,50 28.75,41.75 29.75,40.75 v31.75,40.75
  Bottom 0.61: v31.75,40.75 v62.75,40.75 | T6.1 v13.01,61.24 v13,61.25
N$28
  Bottom 0.61: LED9.C LED8.C 94.5,41 93.25,39.75 93.25,18 95,16.25 LED7.C 94,14.75 80.5,1.5 12.25,1.5 9.5,4 9.5,6.75 7,9 3.5,9 2.5,10 2.5,12.25 3.5,13.25 LED6.C 6.25,13.25 7,14 7,56.5 | LED5.C LED10.C 6.5,65.75 7,65.25 7,56.5 | 7,56.5 8,57.5 T6.3
N$32  (via drill 0.6)
  Top 0.61: RN2.12 48.27,22.21 SW1-7.S1 | RN1.12 81.73,48.27 v81.75,48.25
  Top 1.016: 51.23,19.5 SW1-7.S1 51.11,19.39 55.75,19.39 57,18.14 D12.3
  Bottom 0.61: v81.75,48.25 81.75,47 80.75,46 75,46 74,45 74,22 71.38,19.38 SW1-7.S1
N$33  (via drill 0.6)
  Top 0.61: RN2.11 47,22.06 43.44,18.51 SW1-7.A | RN1.13 82.71,49.54 83.25,49 v83.25,48.25
  Top 0.813: D10.3 49.5,13.45 48.49,14.46 43.96,14.46 SW1-7.A
  Top 1.016: SW1-7.A 43.45,13.95
  Bottom 0.61: v83.25,48.25 83.25,46 82,44.75 75.75,44.75 75.25,44.25 75.25,21.25 67.94,13.94 SW1-7.A
N$34  (via drill 0.6)
  Top 0.61: RN2.9 44.46,28.05 SW1-7.B | RN1.14 82.94,50.81 86.5,49 v86.5,48.25
  Top 1.016: D11.3 42.33,24.5 43.45,25.62 SW1-7.B
  Bottom 0.61: SW1-7.B 34.5,17.59 34.5,9.75 38.25,2.75 79.5,2.75 82.25,5.5 82.25,23.25 86.5,27.5 v86.5,48.25
N$35  (via drill 0.6)
  Top 0.61: RN2.8 43.19,37.19 41.5,35.5 37.5,35.5 34,32 | SW1-7.S3 34,24.25 | v66.75,40.75 66.75,43 69.48,45.73 RN1.5
  Top 1.016: 34,24.25 34,32 35,33 D7.3
  Bottom 0.61: v66.75,40.75 66.75,39.75 66.25,39.25 35,39.25 34,37.5 34,24.25 SW1-7.S3
N$36  (via drill 0.6)
  Top 0.61: RN2.13 49.54,38.46 52.5,35.5 54,35.5 | 57.14,35.5 SW1-7.S4 | v68.25,40.75 68.25,42.75 69.96,44.46 RN1.6
  Top 1.016: 57.14,35.5 54,35.5 53,34.5 D8.3
  Bottom 0.61: v68.25,40.75 68.25,36.75 67,35.5 57.17,35.5 SW1-7.S4
N$37  (via drill 0.6)
  Top 0.61: RN2.14 50.81,38.69 51.5,38 58.75,38 v64,32.75 66,30.5 66,17.3 SW1-7.S5 | v69.75,40.75 69.75,42.25 70.69,43.19 RN1.7
  Top 1.016: D9.3 62.5,18.58 63.84,17.24 SW1-7.S5
  Bottom 0.61: v69.75,40.75 69.75,34 68.5,32.75 v64,32.75
OSC1
  Top 0.406: PIC1.30 70.52,69.37 71.2,70.05 OSCIC1.3
PGC
  Top 0.406: PIC1.16 62.43,57.82 64,56.25 J2.5
PGD
  Top 0.406: PIC1.17 63.23,58.02 64.25,57 81.81,57 83.61,58.8 J2.4
PHOTORESISTER  (via drill 0.6)
  Top 0.406: v64.75,64.25 66,64.25 66.43,63.82 PIC1.21
  Top 1.27: PR1.P$1 89.25,34.75 P2.P$1 R3.1
  Bottom 0.406: v64.75,64.25 66.25,64.25 66.75,64.75 66.75,68.25 65,70 62.75,70 62.25,70.5 62.25,74 63.25,75 72,75 77,79.75 89.75,79.75 92.5,77 92.5,70.25 93.75,69 93.75,41.75 91.75,39.75 91.75,35.5 91.25,35 P2.P$1
PIC_!CS  (via drill 0.6)
  Top 0.406: PIC1.24 71.93,64.57 73.25,63.25 v76.5,63.25 | v89,41.25 90.5,41.25 91.25,40.5 91.25,37 90.5,36.25 87.75,36.25 87.25,35.75 87.25,34.5 83.5,30.75 79.25,30.75 76.1,33.9 U$3.P$4
  Bottom 0.406: v76.5,63.25 78.25,63.25 84.25,69.25 89.75,69.25 91.5,67.5 91.5,43.75 v89,41.25
PIC_SCK  (via drill 0.6)
  Top 0.406: PIC1.9 59.12,65.37 59.75,66 59.75,69.25 60.5,70 65.5,70 v67,71.5 | v89,39.75 90,39.75 90.5,39.25 90.5,37.5 90,37 87,37 86.5,36.5 86.5,34.75 83.25,31.5 79.5,31.5 76.45,34.55 U$3.P$5
  Bottom 0.406: v67,71.5 67,72.5 67.5,73 72.5,73 78,78.25 88.75,78.25 91,76 91,69.25 92.25,68 92.25,43 v89,39.75
PIC_SDI
  Top 0.406: PIC1.8 55.67,66.17 54.75,65.25 54.75,58.75 60.25,53.25 60.25,40 65.45,34.55 U$3.P$16
PIC_SDO  (via drill 0.6)
  Top 0.406: PIC1.1 64.23,71.77 v65,71.5 | U$3.P$6 76.8,35.2 79.75,32.25 83,32.25 85.75,35 85.75,37.75 86.25,38.25 v89,38.25
  Bottom 0.406: v65,71.5 65,73.25 65.75,74 72.25,74 77.5,79 89.25,79 91.75,76.5 91.75,69.75 93,68.5 93,42.25 v89,38.25
RESET
  Top 0.406: PIC1.18 64.03,58.22 64.5,57.75 81.25,57.75 83.25,59.75 83.25,63.25 83.88,63.88 J2.2
S1
  Top 0.406: RN1.3 66.48,48.27 55.5,59.25 55.5,64 56.07,64.57 PIC1.10
S2
  Top 0.406: PIC1.32 69.97,70.97 70.75,71.75 70.75,77.5 71.5,78.25 83.5,78.25 91,69.75 91,48 90,47 RN1.11
S3
  Top 0.406: PIC1.35 66.43,76.68 68.75,79 84,79 92,70 92,47.5 90.23,45.73 RN1.10
S4
  Top 0.406: PIC1.36 65.63,77.13 68.25,79.75 84.5,79.75 93,70.25 93,47 90.46,44.46 RN1.9 79.66,44.42
S5  (via drill 0.6)
  Top 0.406: RN1.8 79.64,43.17 78.33,43.17 77.75,43.75 77.75,51.5 78.75,52.5 v80.5,52.5 | PIC1.22 67.23,60.77 69,59 v80.5,59
  Bottom 0.406: v80.5,52.5 v80.5,59
VOUT
  Top 0.61: L1.P$2 15.63,70.87 18.5,68 26.5,68 27.5,69 R19.2
  Top 1.016: C5.+ 8,71 arc104 L1.P$2 | R19.2 30.4,70.05 T3.B
  pour Top (isolate 0.61, no thermals): 9.74,69.19 5.74,69.19 5.75,74.75 6.75,74.75 8.5,72.5 9.75,72.5

### Text on the board
tPlace: Alarm Clock | + | - | rev 2.2
lineup: 88 | 100